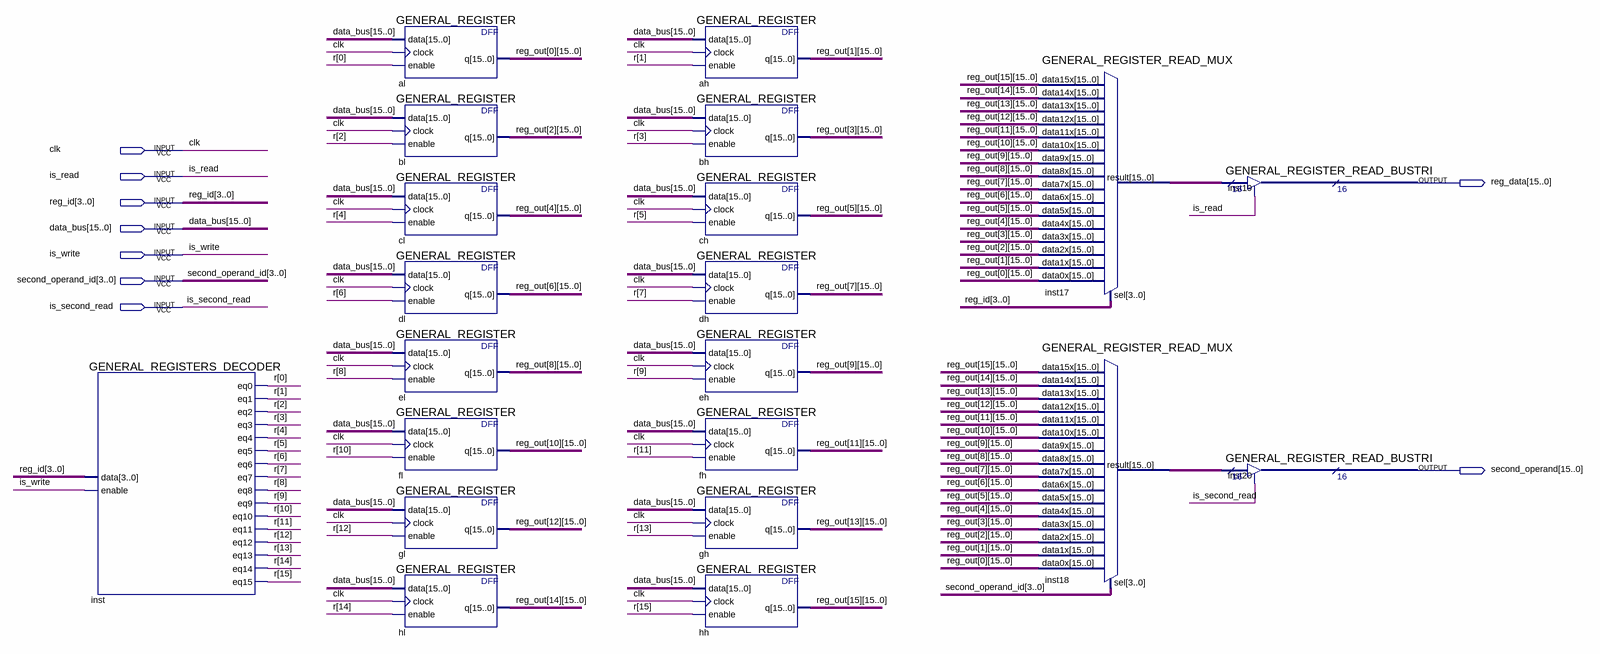
[diagram p0: schematic sheet]
// Quartus schematic GENERAL_REGISTERS.bdf as structural Verilog: 21 symbols, 9 pins
module GENERAL_REGISTERS (
  input  clk,
  input  is_read,
  input  [3:0] reg_id,
  input  [15:0] data_bus,
  input  is_write,
  input  [3:0] second_operand_id,
  input  is_second_read,
  output [15:0] reg_data,
  output [15:0] second_operand
);

  wire [15:0] inst17_result, inst18_result, r, reg_out_0, reg_out_1, reg_out_2, reg_out_3, reg_out_4,
       reg_out_5, reg_out_6, reg_out_7, reg_out_8, reg_out_9, reg_out_10, reg_out_11, reg_out_12, reg_out_13,
       reg_out_14, reg_out_15;

  GENERAL_REGISTERS_DECODER inst (
    .data(reg_id), .enable(is_write), .eq0(r[0]), .eq1(r[1]), .eq2(r[2]), .eq3(r[3]), .eq4(r[4]), .eq5(r[5]),
    .eq6(r[6]), .eq7(r[7]), .eq8(r[8]), .eq9(r[9]), .eq10(r[10]), .eq11(r[11]), .eq12(r[12]), .eq13(r[13]),
    .eq14(r[14]), .eq15(r[15]));
  GENERAL_REGISTER al (.data(data_bus), .clock(clk), .enable(r[0]), .q(reg_out_0));
  GENERAL_REGISTER bl (.data(data_bus), .clock(clk), .enable(r[2]), .q(reg_out_2));
  GENERAL_REGISTER cl (.data(data_bus), .clock(clk), .enable(r[4]), .q(reg_out_4));
  GENERAL_REGISTER dl (.data(data_bus), .clock(clk), .enable(r[6]), .q(reg_out_6));
  GENERAL_REGISTER el (.data(data_bus), .clock(clk), .enable(r[8]), .q(reg_out_8));
  GENERAL_REGISTER fl (.data(data_bus), .clock(clk), .enable(r[10]), .q(reg_out_10));
  GENERAL_REGISTER gl (.data(data_bus), .clock(clk), .enable(r[12]), .q(reg_out_12));
  GENERAL_REGISTER hl (.data(data_bus), .clock(clk), .enable(r[14]), .q(reg_out_14));
  GENERAL_REGISTER ah (.data(data_bus), .clock(clk), .enable(r[1]), .q(reg_out_1));
  GENERAL_REGISTER bh (.data(data_bus), .clock(clk), .enable(r[3]), .q(reg_out_3));
  GENERAL_REGISTER ch (.data(data_bus), .clock(clk), .enable(r[5]), .q(reg_out_5));
  GENERAL_REGISTER dh (.data(data_bus), .clock(clk), .enable(r[7]), .q(reg_out_7));
  GENERAL_REGISTER eh (.data(data_bus), .clock(clk), .enable(r[9]), .q(reg_out_9));
  GENERAL_REGISTER fh (.data(data_bus), .clock(clk), .enable(r[11]), .q(reg_out_11));
  GENERAL_REGISTER gh (.data(data_bus), .clock(clk), .enable(r[13]), .q(reg_out_13));
  GENERAL_REGISTER hh (.data(data_bus), .clock(clk), .enable(r[15]), .q(reg_out_15));
  GENERAL_REGISTER_READ_MUX inst17 (
    .data15x(reg_out_15), .data14x(reg_out_14), .data13x(reg_out_13), .data12x(reg_out_12),
    .data11x(reg_out_11), .data10x(reg_out_10), .data9x(reg_out_9), .data8x(reg_out_8), .data7x(reg_out_7),
    .data6x(reg_out_6), .data5x(reg_out_5), .data4x(reg_out_4), .data3x(reg_out_3), .data2x(reg_out_2),
    .data1x(reg_out_1), .data0x(reg_out_0), .sel(reg_id), .result(inst17_result));
  GENERAL_REGISTER_READ_MUX inst18 (
    .data15x(reg_out_15), .data14x(reg_out_14), .data13x(reg_out_13), .data12x(reg_out_12),
    .data11x(reg_out_11), .data10x(reg_out_10), .data9x(reg_out_9), .data8x(reg_out_8), .data7x(reg_out_7),
    .data6x(reg_out_6), .data5x(reg_out_5), .data4x(reg_out_4), .data3x(reg_out_3), .data2x(reg_out_2),
    .data1x(reg_out_1), .data0x(reg_out_0), .sel(second_operand_id), .result(inst18_result));
  GENERAL_REGISTER_READ_BUSTRI inst19 (.enabledt(is_read), .data(inst17_result), .tridata(reg_data));
  GENERAL_REGISTER_READ_BUSTRI inst20 (.enabledt(is_second_read), .data(inst18_result), .tridata(second_operand));
endmodule
